# Altium schematic sheet Power.SchDoc: WZ1262 - WIZnet Connect the Magic 2014 Design Challenge
size A4; DocumentNumber: 4; Revision: 1.0; SheetNumber: 4; SheetTotal: 4
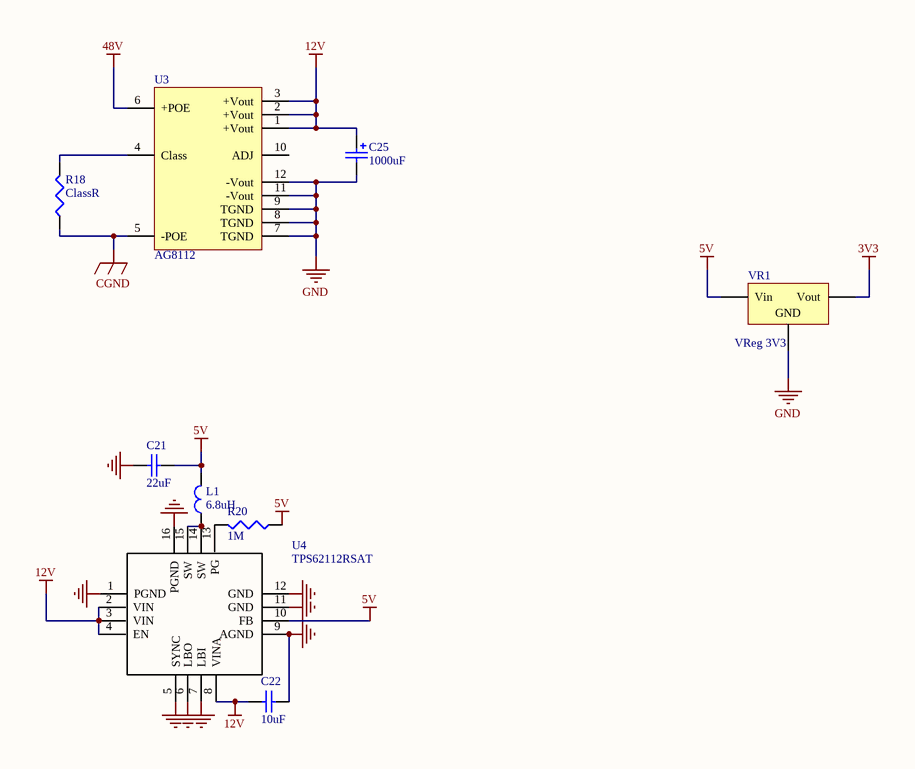
[diagram p0: Power.SchDoc]

## Parts
C21  22uF  [1210]
C22  10uF  [0603]
C25  1000uF  [PANASONIC_H13]
L1  6.8uH  [1812]
R18  ClassR  [0603]  (no BOM)
R20  1M  [0603]
U3  AG8112  [AG8100]
U4  TPS62112RSAT  [16-QFN]
VR1  VReg 3V3  [SOT223]

## Nets
3V3: VR1.3(Vout)
5V: C21.2 L1.2 R20.1 U4.10(FB) VR1.1(Vin)
12V: C22.1 C25.+ U3.1(+Vout) U3.2(+Vout) U3.3(+Vout) U4.2(VIN) U4.3(VIN) U4.4(EN) U4.8(VINA)
48V: U3.6(+POE)
CGND: R18.1 U3.5(-POE)
GND: C21.1 C22.2 C25.- U3.7(TGND) U3.8(TGND) U3.9(TGND) U3.11(-Vout) U3.12(-Vout) U4.0(GND) U4.1(PGND) U4.5(SYNC) U4.6(LBO) U4.7(LBI) U4.9(AGND) U4.11(GND) U4.12(GND) U4.16(PGND) VR1.2(GND)
NetL1_1: L1.1 U4.14(SW) U4.15(SW)
NetR18_2: R18.2 U3.4(Class)
NetR20_2: R20.2 U4.13(PG)

Not connected (* = marked no-connect by the designer): U3 10(ADJ)

## Library data of the parts
C21 = Cap_22uF: Capacitor (Semiconductor SIM Model); Published: 8-Jun-2000; LatestRevisionDate: 29-May-2009; LatestRevisionNote: IPC-7351 Footprint Added.; PackageReference: C1206; Publisher: Altium Limited; PackageDescription: Chip Capacitor; Value: 22uF; Supplier 1: Digi-Key; Supplier 2: Mouser; Supplier Part Number 1: 587-1395-1-ND; Supplier Part Number 2: 963-LMK325F226ZN-T
C22 = Cap_10uF: Capacitor (Semiconductor SIM Model); Value: 10uF - 25V; Published: 8-Jun-2000; LatestRevisionDate: 29-May-2009; LatestRevisionNote: IPC-7351 Footprint Added.; PackageReference: C1206; Publisher: Altium Limited; PackageDescription: Chip Capacitor; Supplier 1: Digi-Key; Supplier 2: Mouser; Supplier Part Number 1: 445-9015-1-ND; Supplier Part Number 2: 810-C1608X5R1E106M
C25 = Cap_Polarized_1000uF: Polarized Capacitor (Surface Mount); Published: 8-Jun-2000; LatestRevisionDate: 29-May-2009; LatestRevisionNote: IPC-7351 Footprint Added.; PackageReference: C0805; Publisher: Altium Limited; PackageDescription: Chip Capacitor; Value: 1000uF; Supplier 1: Digi-Key; Supplier 2: Mouser; Supplier Part Number 1: PCE3462CT-ND; Supplier Part Number 2: 140-VE102M1ETR1313
L1 = INDUCTOR: INDUCTOR WW 6.8UH 1.1A 1812 SMD; MPN: 744045006; SPN: 732-4064-6-ND; Cost10: 1.68800; Cost100: 1.28250; Supplier: Digikey; Supplier 1: Digi-Key; Supplier 2: Mouser; Supplier Part Number 1: 490-2518-1-ND; Supplier Part Number 2: 81-LQH43CN6R8M03L
R18 = Resistor: Value: ??; Published: 8-Jun-2000; LatestRevisionDate: 29-May-2009; LatestRevisionNote: IPC-7351 Footprint Added.; PackageReference: J1-0603; Publisher: Altium Limited; PackageDescription: Chip Resistor; Supplier 1: Digi-Key; Supplier 2: Mouser
R20 = Resistor_1M: Resistor; Published: 8-Jun-2000; LatestRevisionDate: 29-May-2009; LatestRevisionNote: IPC-7351 Footprint Added.; PackageReference: J1-0603; Publisher: Altium Limited; PackageDescription: Chip Resistor; Value: 1M; Supplier 1: Digi-Key; Supplier 2: Mouser
U3 = AG8100: POE Controller and Buck Converter
U4 = TPS62112RSAT: IC REG BUCK SYNC 5V 1.5A 16QFN; SPN: 296-19717-6-ND; Cost10: 3.83100; Cost100: 2.00480; MPN: TPS62112RSAT; Supplier: Digikey; Supplier 1: Digi-Key; Supplier 2: Mouser; Supplier Part Number 1: 296-19717-1-ND; Supplier Part Number 2: 595-TPS62112RSAT
VR1 = Volt Reg: Voltage Regulator; Part: UA78M33; Published: 24-Mar-1999; LatestRevisionDate: 29-May-2009; LatestRevisionNote: IPC-7351 Footprint Added.; PackageReference: D2PAK; Publisher: Altium Limited; PackageDescription: 3-Pin Transistor Outline Package 2.54 mm Pitch, 15.1 mm Lead Span; Supplier 1: Digi-Key; Supplier 2: Mouser; Supplier Part Number 1: 296-27140-5-ND; Supplier Part Number 2: 595-UA78M33CDCY